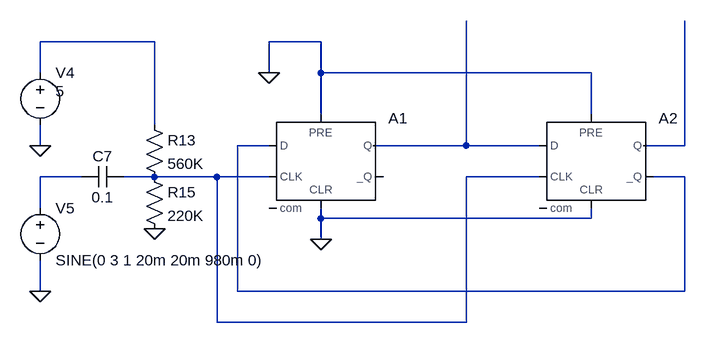
[diagram p0: schematic lo.asc]
lo.asc, the LTspice schematic file:
Version 4
SHEET 1 3044 748
WIRE 2192 -304 2016 -304
WIRE 2448 -304 2368 -304
WIRE 2016 -256 2016 -304
WIRE 2368 -256 2368 -304
WIRE 2448 -256 2448 -304
WIRE 2864 -256 2448 -256
WIRE 2448 -192 2448 -256
WIRE 2864 -192 2864 -256
WIRE 2192 -176 2192 -304
WIRE 2016 -144 2016 -176
WIRE 2368 -144 2320 -144
WIRE 2672 -144 2672 -336
WIRE 2672 -144 2528 -144
WIRE 2784 -144 2672 -144
WIRE 3008 -144 3008 -336
WIRE 3008 -144 2944 -144
WIRE 2080 -96 2016 -96
WIRE 2192 -96 2144 -96
WIRE 2288 -96 2192 -96
WIRE 2368 -96 2288 -96
WIRE 2784 -96 2672 -96
WIRE 3008 -96 2960 -96
WIRE 2016 -48 2016 -96
WIRE 2448 -32 2448 -48
WIRE 2864 -32 2864 -48
WIRE 2864 -32 2448 -32
WIRE 2448 0 2448 -32
WIRE 2016 80 2016 32
WIRE 2320 80 2320 -144
WIRE 3008 80 3008 -96
WIRE 3008 80 2320 80
WIRE 2288 128 2288 -96
WIRE 2672 128 2672 -96
WIRE 2672 128 2288 128
FLAG 2016 80 0
FLAG 2368 -256 0
FLAG 2448 0 0
FLAG 2192 -16 0
FLAG 2016 -144 0
SYMBOL Digital\\dflop 2448 -192 R0
SYMATTR InstName A1
SYMBOL voltage 2016 -64 R0
WINDOW 123 24 124 Left 2
WINDOW 39 0 0 Left 0
SYMATTR InstName V5
SYMATTR Value SINE(0 3 1 20m 20m 980m 0)
SYMBOL res 2176 -112 R0
SYMATTR InstName R15
SYMATTR Value 220K
SYMBOL res 2176 -192 R0
SYMATTR InstName R13
SYMATTR Value 560K
SYMBOL voltage 2016 -272 R0
WINDOW 3 24 44 Left 2
WINDOW 123 24 124 Left 2
WINDOW 39 0 0 Left 0
SYMATTR InstName V4
SYMATTR Value 5
SYMBOL cap 2144 -112 R90
WINDOW 0 0 32 VBottom 2
WINDOW 3 32 32 VTop 2
SYMATTR InstName C7
SYMATTR Value 0.1
SYMBOL Digital\\dflop 2864 -192 R0
SYMATTR InstName A2

The netlist it stands for:
* lo.asc
A1 N002 0 N006 0 0 0 N003 0 DFLOP
V5 N005 0 SINE(0 3 1 20m 20m 980m 0)
R15 N006 0 220K
R13 N001 N006 560K
V4 N001 0 5
C7 N006 N005 0.1
A2 N003 0 N006 0 0 N002 N004 0 DFLOP
.backanno
.end